# EAGLE design Bosch (EAGLE 9.6.1)
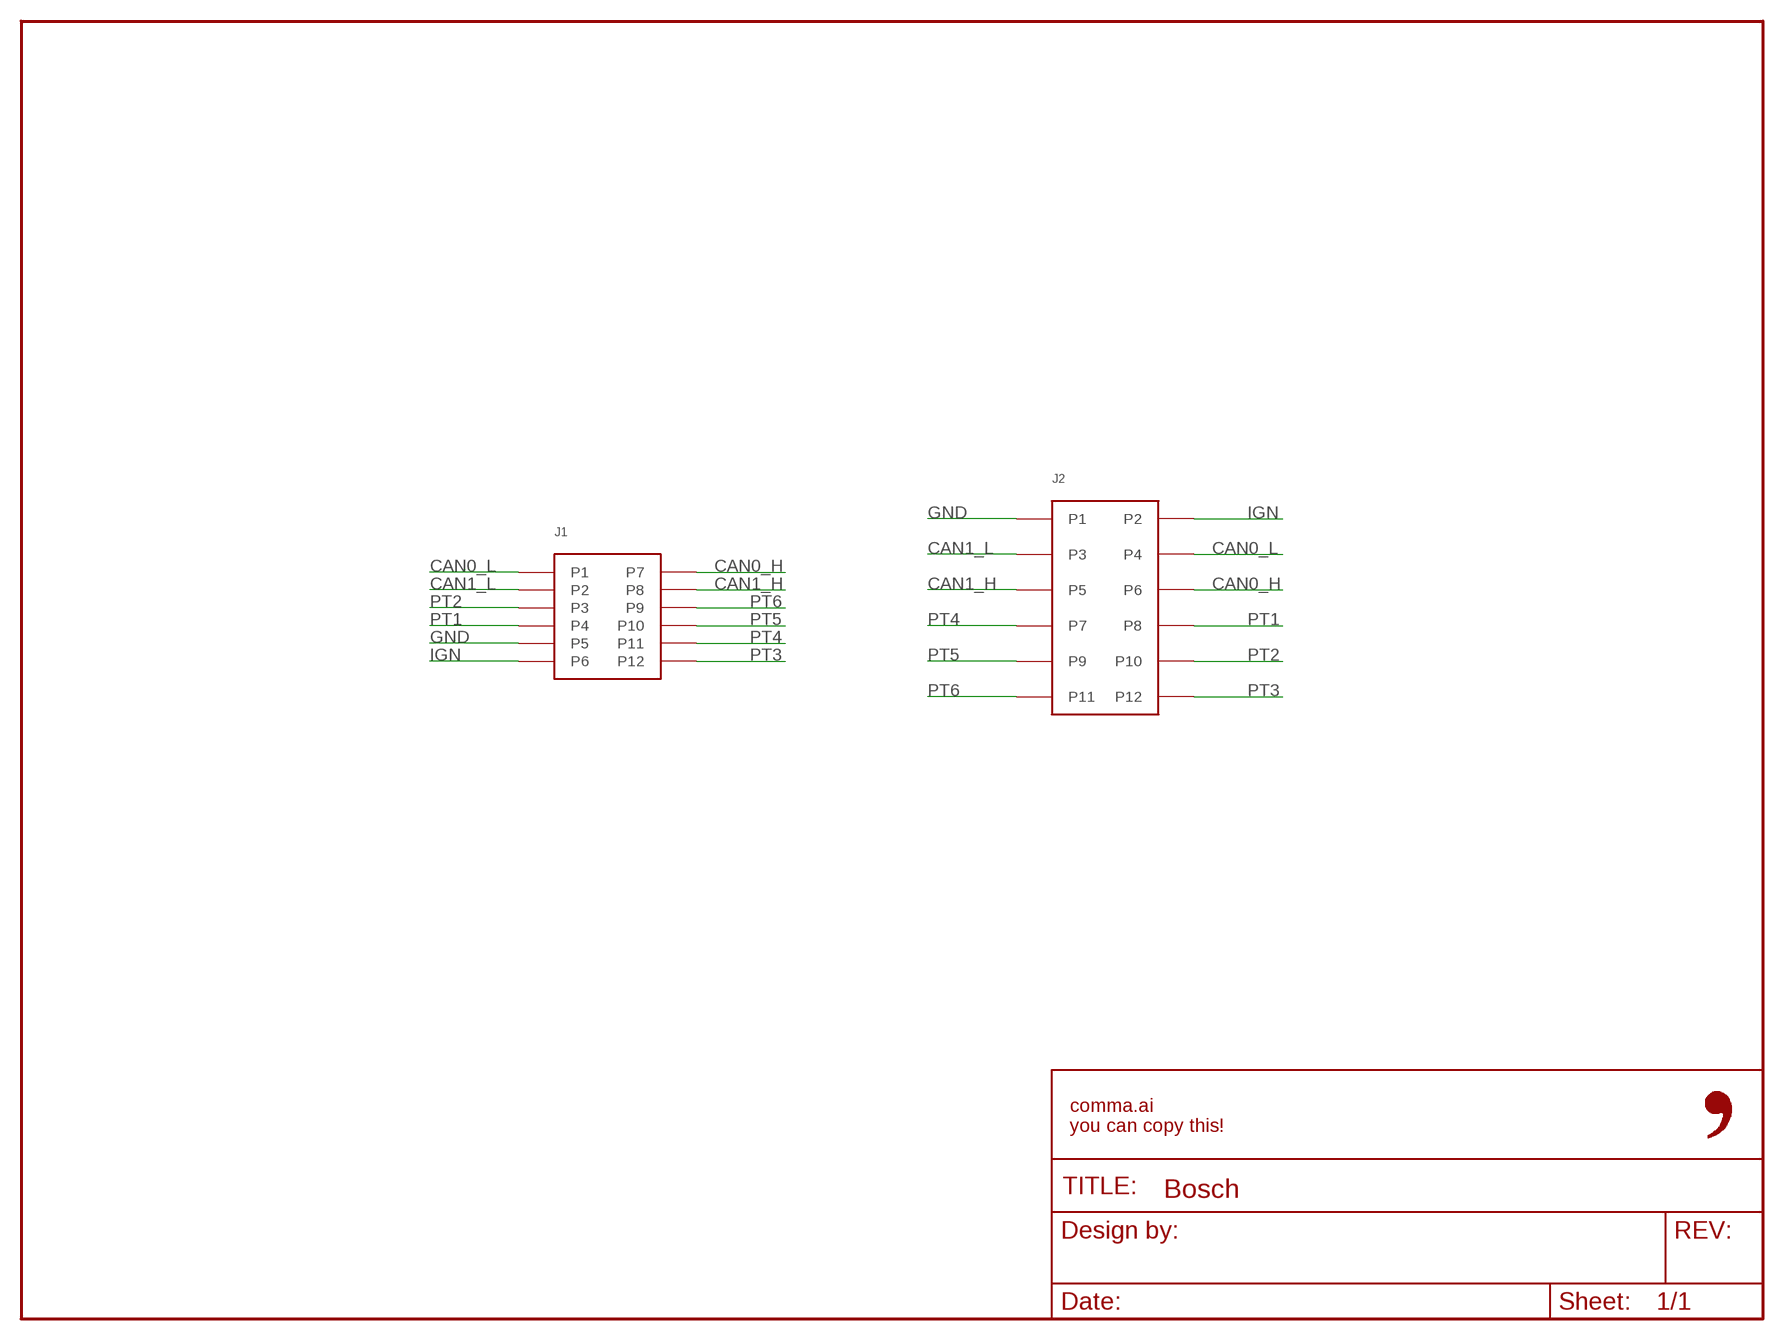
[diagram p0: schematic, sheet 1]

## Parts
FRAME1  FRAME-LETTER-OPENNO_PACKAGE  [DUMMY]
J1  MX34M12NF1  [MX34M12NF1]
J2  5018761240  [5018761240]

## Nets
CAN0_H: J1.P7 J2.P6
CAN0_L: J1.P1 J2.P4
CAN1_H: J1.P8 J2.P5
CAN1_L: J1.P2 J2.P3
GND: J1.P5 J2.P1
IGN: J1.P6 J2.P2
PT1: J1.P4 J2.P8
PT2: J1.P3 J2.P10
PT3: J1.P12 J2.P12
PT4: J1.P11 J2.P7
PT5: J1.P10 J2.P9
PT6: J1.P9 J2.P11

## Library data of the parts
FRAME1 = comma.ai:FRAME-LETTER-OPEN: Schematic Frame - Letter Standard 8.5x11 US Letter frame; DESIGNER: Nobody; VERSION: v01
J1 = comma.ai:MX34M12NF1; CPN: CAI-HARNESS-JAE-MX34M12NF1; MPN: MX34M12NF1
J2 = 5018761440:5018761240; CPN: CAI-HARNESS-MOLEX-5018761240; MPN: 5018761240

## Board
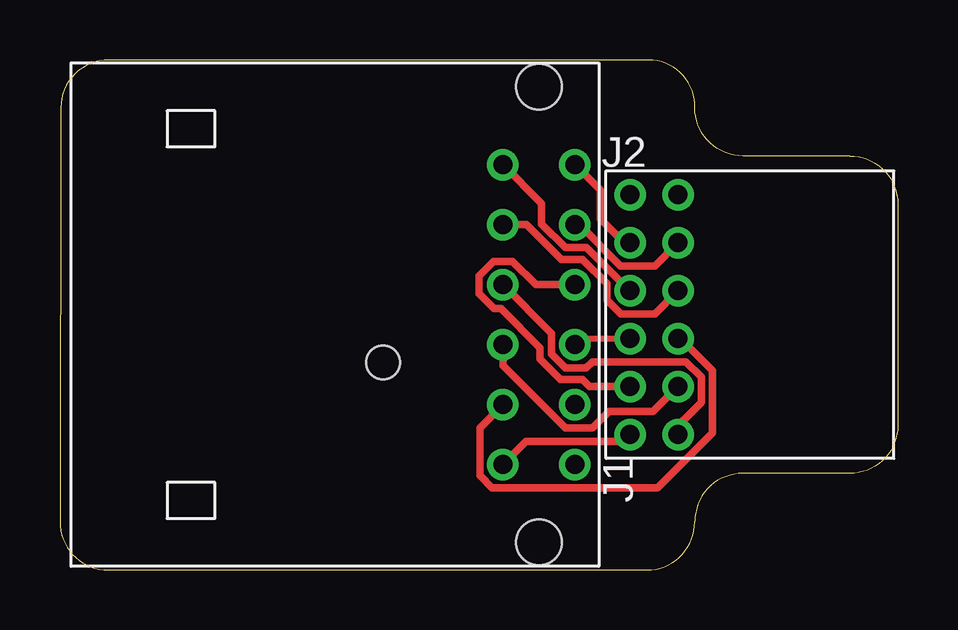
[diagram p1: board, top side]
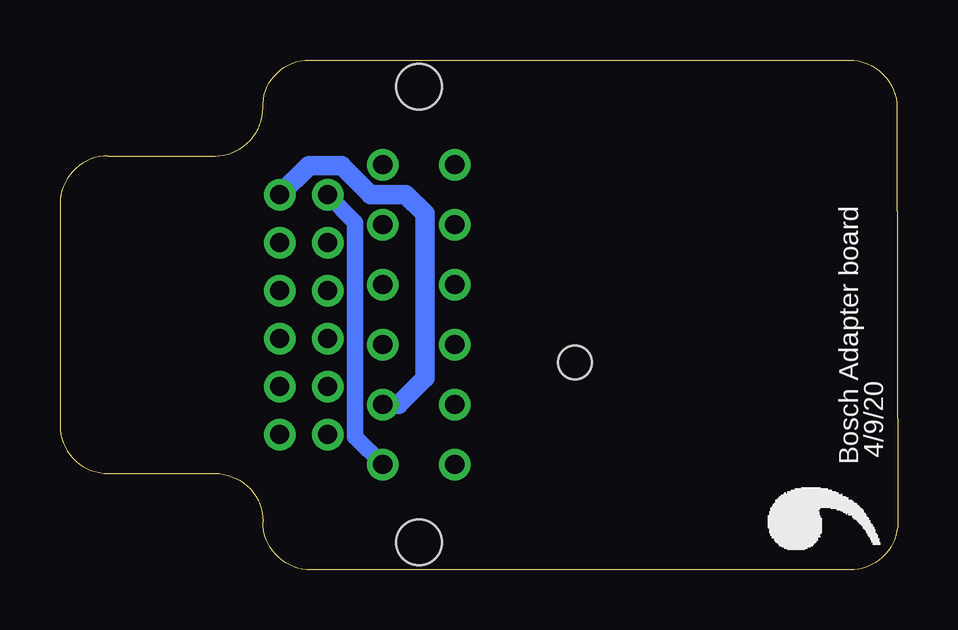
[diagram p2: board, bottom side, seen from below]

Size 34.93 x 21.27 mm. Coordinates in mm from the lower left corner, seen from the top.
Outline: 32.93,4.03 28.47,4.03 arc90 26.47,2.03 26.47,2 arc-90 24.47,0 2,0 arc-90 0,2 0.03,19.27 arc-90 2.03,21.27 24.54,21.27 arc-92 26.47,19.27 arc90 28.47,17.27 32.93,17.27 arc-90 34.93,15.27 34.93,6.03 arc-90 32.93,4.03
Copper layers (1*16): Top 0.035mm / dielectric 1.5mm / Bottom 0.035mm
Design rules "default": minimum track width 6mil, minimum drill 0.35mm, track to track 6mil, track to pad 6mil, pad to pad 6mil, via to via 6mil, smd to smd 6mil, copper to edge 40mil, drill to drill 6mil, minimum pad ring 10mil, minimum via ring 8mil, stop-mask expansion 4mil, vias tented up to drill 0mil, thermal gap 10mil

### Footprints (pad centres in the part's own frame; a part is rotated, then mirrored left to right if it is on the bottom)
MX34M12NF1 = drill 0.8: P1 6.25,0; P2 3.75,0; P3 1.25,0; P4 -1.25,0; P5 -3.75,0; P6 -6.25,0; P7 6.25,3; P8 3.75,3; P9 1.25,3; P10 -1.25,3; P11 -3.75,3; P12 -6.25,3 | hole 1.9: -9.5,1.5; 9.5,1.5 | hole 1.4: -2,8
5018761240 = drill 0.8: P1 5,-1; P2 5,1; P3 3,-1; P4 3,1; P5 1,-1; P6 1,1; P7 -1,-1; P8 -1,1; P9 -3,-1; P10 -3,1; P11 -5,-1; P12 -5,1

### Placement (x,y rotation side)
E$1  [LOGO]  0.43,0.17 90 bottom
FRAME1  24.77,0.49 0 top
J1  21.47,10.65 90 top
J2  24.77,10.65 90 top

### Tracks (layer width: path | path; a pad name or v marks a point on that pad's centre or on a via)
CAN0_H
  Top 0.305: J1.P7 20.08,15.29 20.08,14.43 21.07,13.44 21.96,13.44 23.75,11.65 J2.P6
CAN0_L
  Top 0.305: J1.P1 22.53,15.84 22.53,14.64 23.52,13.65 J2.P4
CAN1_H
  Top 0.305: J2.P5 24.79,10.68 23.38,10.68 22.79,11.26 22.79,11.95 21.79,12.95 20.9,12.95 19.46,14.4 J1.P8
CAN1_L
  Top 0.305: J1.P2 21.66,14.4 23.37,12.69 24.8,12.69 J2.P3
GND
  Bottom 0.813: J2.P1 24.55,16.87 23.19,16.87 21.98,15.66 20.52,15.66 19.72,14.86 19.72,8 20.82,6.9 J1.P5
IGN
  Bottom 0.68: J1.P6 22.62,5.55 22.62,14.5 J2.P2
PT1
  Top 0.254: J1.P4 21.72,9.65 J2.P8
PT2
  Top 0.305: J2.P10 22.07,7.66 21.78,7.94 20.87,7.94 20.02,8.79 20.02,9.27 18.38,10.91 18.09,10.91 17.46,11.53 17.46,12.27 18.07,12.87 18.86,12.87 19.84,11.9 J1.P3
PT3
  Top 0.305: J1.P12 19.43,5.36 23.48,5.36 J2.P12
PT4
  Top 0.305: J2.P7 25.87,9.65 27.2,8.32 27.2,5.72 24.91,3.44 18.02,3.44 17.5,3.95 17.5,5.94 J1.P11
PT5
  Top 0.305: J2.P9 24.73,6.61 22.88,6.61 22.19,5.93 21.07,5.93 18.47,8.53 J1.P10
PT6
  Top 0.305: J2.P11 25.77,6.02 26.73,6.98 26.73,8.05 26.09,8.69 22.19,8.69 21.94,8.43 21.07,8.43 20.5,9 20.5,9.87 J1.P9

### Text on the board
bPlace: Bosch Adapter board | 4/9/20